# Altium schematic sheet USB Charger.SchDoc
size A4; SheetNumber: 4; SheetTotal: 4
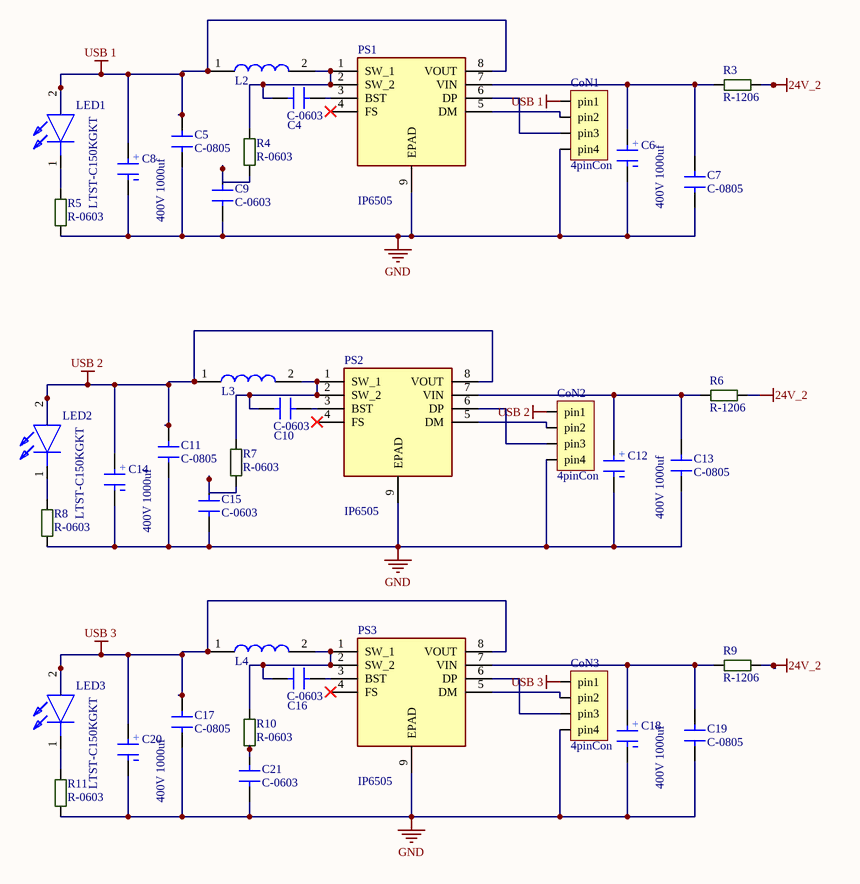
[diagram p0: USB Charger.SchDoc]

## Parts
C4  C-0603  [C-0603W]
C5  C-0805  [C-0805W]
C6  400V 1000uf  [CAP_EEETC1C331V]
C7  C-0805  [C-0805W]
C8  400V 1000uf  [CAP_EEETC1C331V]
C9  C-0603  [C-0603W]
C10  C-0603  [C-0603W]
C11  C-0805  [C-0805W]
C12  400V 1000uf  [CAP_EEETC1C331V]
C13  C-0805  [C-0805W]
C14  400V 1000uf  [CAP_EEETC1C331V]
C15  C-0603  [C-0603W]
C16  C-0603  [C-0603W]
C17  C-0805  [C-0805W]
C18  400V 1000uf  [CAP_EEETC1C331V]
C19  C-0805  [C-0805W]
C20  400V 1000uf  [CAP_EEETC1C331V]
C21  C-0603  [C-0603W]
CoN1  4pinCon  [4pinCon]
CoN2  4pinCon  [4pinCon]
CoN3  4pinCon  [4pinCon]
L2  inducter_SMPI06050  [inductor]  (value not drawn)
L3  inducter_SMPI06050  [inductor]  (value not drawn)
L4  inducter_SMPI06050  [inductor]  (value not drawn)
LED1  LTST-C150KGKT  [LED1206]
LED2  LTST-C150KGKT  [LED1206]
LED3  LTST-C150KGKT  [LED1206]
PS1  IP6505  [IP6505]
PS2  IP6505  [IP6505]
PS3  IP6505  [IP6505]
R3  R-1206  [R-1206W]
R4  R-0603  [R-0603W]
R5  R-0603  [R-0603W]
R6  R-1206  [R-1206W]
R7  R-0603  [R-0603W]
R8  R-0603  [R-0603W]
R9  R-1206  [R-1206W]
R10  R-0603  [R-0603W]
R11  R-0603  [R-0603W]

## Nets
24V_2: R3.1 R6.1 R9.1
GND: C5.1 C6.2 C7.1 C8.2 C9.1 C11.1 C12.2 C13.1 C14.2 C15.1 C17.1 C18.2 C19.1 C20.2 C21.1 CoN1.4(pin4) CoN2.4(pin4) CoN3.4(pin4) PS1.9(EPAD) PS2.9(EPAD) PS3.9(EPAD) R5.1 R8.1 R11.1
USB 1: C5.2 C8.1 CoN1.1(pin1) L2.1 LED1.2(A) PS1.8(VOUT)
USB 2: C11.2 C14.1 CoN2.1(pin1) L3.1 LED2.2(A) PS2.8(VOUT)
USB 3: C17.2 C20.1 CoN3.1(pin1) L4.1 LED3.2(A) PS3.8(VOUT)
NetC4_1: C4.1 PS1.3(BST)
NetC4_2: C4.2 L2.2 PS1.1(SW_1) PS1.2(SW_2) R4.2
NetC6_1: C6.1 C7.2 PS1.7(VIN) R3.2
NetC9_2: C9.2 R4.1
NetC10_1: C10.1 PS2.3(BST)
NetC10_2: C10.2 L3.2 PS2.1(SW_1) PS2.2(SW_2) R7.2
NetC12_1: C12.1 C13.2 PS2.7(VIN) R6.2
NetC15_2: C15.2 R7.1
NetC16_1: C16.1 PS3.3(BST)
NetC16_2: C16.2 L4.2 PS3.1(SW_1) PS3.2(SW_2) R10.2
NetC18_1: C18.1 C19.2 PS3.7(VIN) R9.2
NetC21_2: C21.2 R10.1
NetCoN1_2: CoN1.2(pin2) PS1.5(DM)
NetCoN1_3: CoN1.3(pin3) PS1.6(DP)
NetCoN2_2: CoN2.2(pin2) PS2.5(DM)
NetCoN2_3: CoN2.3(pin3) PS2.6(DP)
NetCoN3_2: CoN3.2(pin2) PS3.5(DM)
NetCoN3_3: CoN3.3(pin3) PS3.6(DP)
NetLED1_1: LED1.1(K) R5.2
NetLED2_1: LED2.1(K) R8.2
NetLED3_1: LED3.1(K) R11.2

Not connected (* = marked no-connect by the designer): PS1 4(FS)*; PS2 4(FS)*; PS3 4(FS)*

## Notes on the sheet
- (in symbol Aluminum Electrolytic Capacitors) +

## Library data of the parts
C6 C8 C12 C14 C18 C20 = Aluminum Electrolytic Capacitors: Manufacturer: Nichicon; Manufacturer Part Number: LKS1J472MESZ; Capacitance: 4.7mF; Voltage Rating: 63V; Tolerance: 20%; Ripple Current: 3A; Life (Hours): 1000Hour; Supplier 1: Mouser; RoHS: Yes; Mount: Through Hole; Case/Package: Radial; Min Operating Temperature: -40°C; Max Operating Temperature: 85°C; Package Quantity: 250; Packaging: Bulk; Voltage Rating (DC): 63V; Termination: Snap in; Diameter: 22mm; Length: 45mm; Lead Pitch: 0.394inch; Height - Seated (Max): 1.772inch; Supplier Part Number 1: 647-LKS1J472MESZ; ComponentLink2Description: https://www.ozdisan.com/pasif-komponentler/kondansatorler/aluminyum-kondansatorler/PKL5-063V472MM450; ComponentLink2URL: https://www.ozdisan.com/pasif-komponentler/kondansatorler/aluminyum-kondansatorler/PKL5-063V472MM450
LED1-LED3 = LTST-C150KGKT: LED; Manufacturer_Name: Lite-On; Datasheet Link: http://optoelectronics.liteon.com/upload/download/ds22-2000-072/ltst-c150kgkt.pdf; Height: 1.2mm; Manufacturer_Part_Number: LTST-C150KGKT; Mouser Part Number: 859-LTST-C150KGKT; Mouser Price/Stock: https://www.mouser.com/Search/Refine.aspx?Keyword=859-LTST-C150KGKT; RS Part Number: 6920871; RS Price/Stock: https://uk.rs-online.com/web/p/products/6920871
PS1-PS3 = IP6505: Power Supply; Manufacturer_Name: INJOINIC; Datasheet Link: https://datasheet.lcsc.com/szlcsc/INJOINIC-IP6505_C188335.pdf; Height: 1.65mm; Manufacturer_Part_Number: IP6505